# Altium schematic sheet FTDI.SchDoc
size A3; DocumentNumber: 5; SheetNumber: 5; SheetTotal: 9
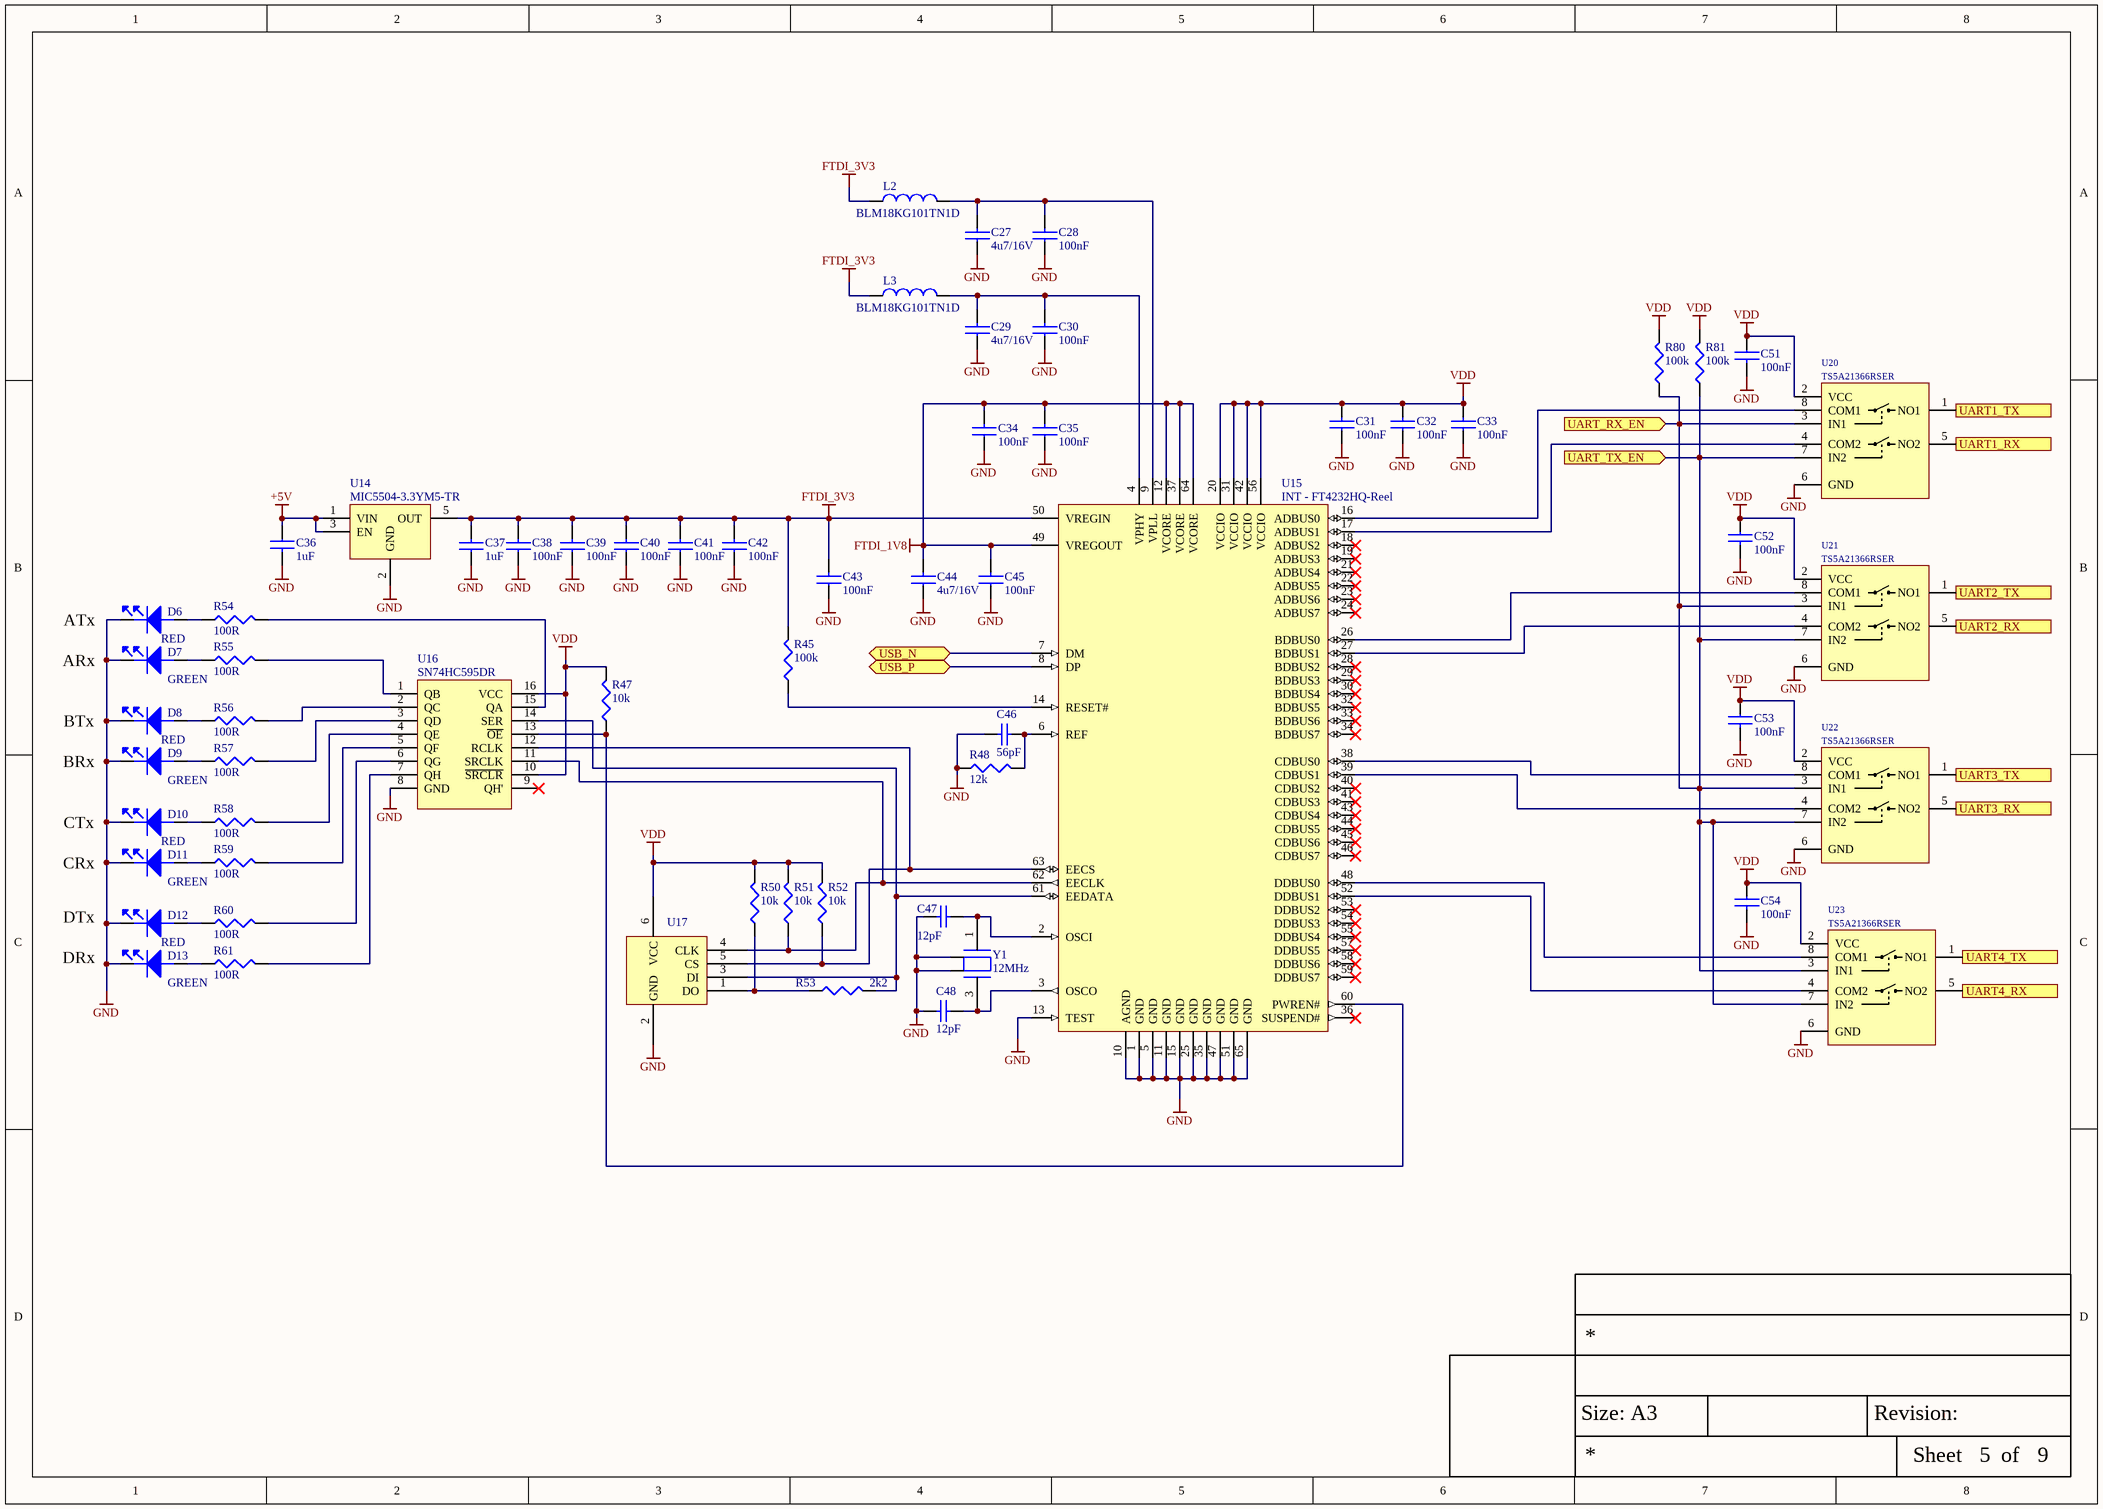
[diagram p0: FTDI.SchDoc]

## Parts
C27  4u7/16V  [CAP0603]
C28  100nF  [CAP0402]
C29  4u7/16V  [CAP0603]
C30  100nF  [CAP0402]
C31  100nF  [CAP0402]
C32  100nF  [CAP0402]
C33  100nF  [CAP0402]
C34  100nF  [CAP0402]
C35  100nF  [CAP0402]
C36  1uF  [CAP0402]
C37  1uF  [CAP0402]
C38  100nF  [CAP0402]
C39  100nF  [CAP0402]
C40  100nF  [CAP0402]
C41  100nF  [CAP0402]
C42  100nF  [CAP0402]
C43  100nF  [CAP0402]
C44  4u7/16V  [CAP0603]
C45  100nF  [CAP0402]
C46  value 56pF  [CAP0402]  (hidden comment: 56pF/50V/0402)
C47  value 12pF  [CAP0402]  (hidden comment: 12pF/50V/0402)
C48  value 12pF  [CAP0402]  (hidden comment: 12pF/50V/0402)
C51  100nF  [CAP0402]
C52  100nF  [CAP0402]
C53  100nF  [CAP0402]
C54  100nF  [CAP0402]
D6  LED RED  [LED0603]  (value not drawn)
D7  LED GREEN  [LED0603]  (value not drawn)
D8  LED RED  [LED0603]  (value not drawn)
D9  LED GREEN  [LED0603]  (value not drawn)
D10  LED RED  [LED0603]  (value not drawn)
D11  LED GREEN  [LED0603]  (value not drawn)
D12  LED RED  [LED0603]  (value not drawn)
D13  LED GREEN  [LED0603]  (value not drawn)
L2  BLM18KG101TN1D  [IND0603]
L3  BLM18KG101TN1D  [IND0603]
R45  100k  [RES0402]
R47  10k  [RES0402]
R48  12k  [RES0402]
R50  10k  [RES0402]
R51  10k  [RES0402]
R52  10k  [RES0402]
R53  2k2  [RES0402]
R54  100R  [RES0402]
R55  100R  [RES0402]
R56  100R  [RES0402]
R57  100R  [RES0402]
R58  100R  [RES0402]
R59  100R  [RES0402]
R60  100R  [RES0402]
R61  100R  [RES0402]
R80  100k  [RES0402]
R81  100k  [RES0402]
U14  MIC5504-3.3YM5-TR  [SOT23-5]
U15  INT - FT4232HQ-Reel  [QFN64_2_N]
U16  SN74HC595DR  [SOIC-16]
U17  93LC56BT-E/OT  [SOT95P270X145-6N]  (value not drawn)
U20  TS5A21366RSER  [UQFN-8]
U21  TS5A21366RSER  [UQFN-8]
U22  TS5A21366RSER  [UQFN-8]
U23  TS5A21366RSER  [UQFN-8]
Y1  12MHz  [CRY2.5X2]

## Ports
UART1_RX (in), UART1_TX (out), UART2_RX (in), UART2_TX (out), UART3_RX (in), UART3_TX (out), UART4_RX (in), UART4_TX (out), UART_RX_EN (in), UART_TX_EN (in), USB_N (bidir), USB_P (bidir)

## Nets
+5V: C36.1 U14.1(VIN) U14.3(EN)
FTDI_1V8: C34.2 C35.2 C44.2 C45.2 U15.12(VCORE) U15.37(VCORE) U15.49(VREGOUT) U15.64(VCORE)
FTDI_3V3: C37.2 C38.2 C39.2 C40.2 C41.2 C42.2 C43.2 L2.1 L3.1 R45.2 U14.5(OUT) U15.50(VREGIN)
GND: C27.1 C28.1 C29.1 C30.1 C31.1 C32.1 C33.1 C34.1 C35.1 C36.2 C37.1 C38.1 C39.1 C40.1 C41.1 C42.1 C43.1 C44.1 C45.1 C46.1 C47.1 C48.1 C51.2 C52.2 C53.2 C54.2 D6.1(cathode) D7.1(cathode) D8.1(cathode) D9.1(cathode) D10.1(cathode) D11.1(cathode) D12.1(cathode) D13.1(cathode) R48.1 U14.2(GND) U15.1(GND) U15.5(GND) U15.10(AGND) U15.11(GND) U15.13(TEST) U15.15(GND) U15.25(GND) U15.35(GND) U15.47(GND) U15.51(GND) U15.65(GND) U16.8(GND) U17.2(GND) U20.6(GND) U21.6(GND) U22.6(GND) U23.6(GND) Y1.2 Y1.4
VDD: C31.2 C32.2 C33.2 C51.1 C52.1 C53.1 C54.1 R47.2 R50.2 R51.2 R52.2 R80.2 R81.2 U15.20(VCCIO) U15.31(VCCIO) U15.42(VCCIO) U15.56(VCCIO) U16.10(~{SRCLR}) U16.16(VCC) U17.6(VCC) U20.2(VCC) U21.2(VCC) U22.2(VCC) U23.2(VCC)
UART1_RX: U20.5(NO2) ; port UART1_RX
UART1_TX: U20.1(NO1) ; port UART1_TX
UART2_RX: U21.5(NO2) ; port UART2_RX
UART2_TX: U21.1(NO1) ; port UART2_TX
UART3_RX: U22.5(NO2) ; port UART3_RX
UART3_TX: U22.1(NO1) ; port UART3_TX
UART4_RX: U23.5(NO2) ; port UART4_RX
UART4_TX: U23.1(NO1) ; port UART4_TX
UART_RX_EN: R80.1 R81.1 U20.3(IN1) U20.7(IN2) U21.3(IN1) U21.7(IN2) U22.3(IN1) U22.7(IN2) U23.3(IN1) U23.7(IN2) ; port UART_RX_EN, port UART_TX_EN
USB_N: U15.7(DM) ; port USB_N
USB_P: U15.8(DP) ; port USB_P
NetC27_2: C27.2 C28.2 L2.2 U15.9(VPLL)
NetC29_2: C29.2 C30.2 L3.2 U15.4(VPHY)
NetC46_2: C46.2 R48.2 U15.6(REF)
NetC47_2: C47.2 U15.2(OSCI) Y1.1
NetC48_2: C48.2 U15.3(OSCO) Y1.3
NetD6_2: D6.2(ANODE) R54.1
NetD7_2: D7.2(ANODE) R55.1
NetD8_2: D8.2(ANODE) R56.1
NetD9_2: D9.2(ANODE) R57.1
NetD10_2: D10.2(ANODE) R58.1
NetD11_2: D11.2(ANODE) R59.1
NetD12_2: D12.2(ANODE) R60.1
NetD13_2: D13.2(ANODE) R61.1
NetR45_1: R45.1 U15.14(RESET#)
NetR47_1: R47.1 U15.60(PWREN#) U16.13(~{OE})
NetR50_1: R50.1 R53.1 U17.1(DO)
NetR51_1: R51.1 U15.62(EECLK) U16.11(SRCLK) U17.4(CLK)
NetR52_1: R52.1 U15.63(EECS) U16.12(RCLK) U17.5(CS)
NetR53_2: R53.2 U15.61(EEDATA) U16.14(SER) U17.3(DI)
NetR54_2: R54.2 U16.15(QA)
NetR55_2: R55.2 U16.1(QB)
NetR56_2: R56.2 U16.2(QC)
NetR57_2: R57.2 U16.3(QD)
NetR58_2: R58.2 U16.4(QE)
NetR59_2: R59.2 U16.5(QF)
NetR60_2: R60.2 U16.6(QG)
NetR61_2: R61.2 U16.7(QH)
NetU15_16: U15.16(ADBUS0) U20.8(COM1)
NetU15_17: U15.17(ADBUS1) U20.4(COM2)
NetU15_26: U15.26(BDBUS0) U21.8(COM1)
NetU15_27: U15.27(BDBUS1) U21.4(COM2)
NetU15_38: U15.38(CDBUS0) U22.8(COM1)
NetU15_39: U15.39(CDBUS1) U22.4(COM2)
NetU15_48: U15.48(DDBUS0) U23.8(COM1)
NetU15_52: U15.52(DDBUS1) U23.4(COM2)

Not connected (* = marked no-connect by the designer): U15 18(ADBUS2)* 19(ADBUS3)* 21(ADBUS4)* 22(ADBUS5)* 23(ADBUS6)* 24(ADBUS7)* 28(BDBUS2)* 29(BDBUS3)* 30(BDBUS4)* 32(BDBUS5)* 33(BDBUS6)* 34(BDBUS7)* 36(SUSPEND#)* 40(CDBUS2)* 41(CDBUS3)* 43(CDBUS4)* 44(CDBUS5)* 45(CDBUS6)* 46(CDBUS7)* 53(DDBUS2)* 54(DDBUS3)* 55(DDBUS4)* 57(DDBUS5)* 58(DDBUS6)* 59(DDBUS7)*; U16 9(QH')*

## Notes on the sheet
- ATx
- ARx
- BTx
- BRx
- CTx
- CRx
- DTx
- DRx
- Size: A3
- Revision:
- Sheet
- of
- (in symbol LED - LED GREEN) GREEN
- (in symbol LED - LED RED) RED

## Library data of the parts
C27 C29 C44 = C - 4u7  16V 0603: MURATA - GRM188R61C475KAAJD - CAP, MLCC, X5R, 4.7UF, 16V, 0603; IRNAS Part No.: I-200001; Ceramic Capacitor Case: 0603 [1608 Metric]; Capacitance: 4.7; Voltage Rating: 16; Capacitance Tolerance: ± 10%; Dielectric Characteristic: X5; Product Range: GRM Series; SVHC: No SVHC (17-Dec-2015)<!--FANDB--><div class="features-and-benefits-container"><div class="features-and-benefits-desc-container"><span class="features-and-benefits-container-desc">SMD Multilayer Ceramic Capacitor, 0603 [1608 Metric], 4.7 µF, 16 V, ± 10%, X5; Supplier 1: Farnell; Manufacturer: MURATA; Manufacturer Part Number: GRM188R61C475KAAJD; RoHS: YES; Stock 1: 5038; Pricing 1: 10=0.16, 100=0.0929, 500=0.076, 1000=0.0618, 2000=0.0605, 4000=0.0425, 20000=0.0409, 40000=0.0355 (GBP); Packaging: Cut Tape; Operating Temperature Min: -55; Operating Temperature Max: 85; Automotive Qualification Standard: -; MSL: MSL 1 - Unlimited; ComponentLink1URL: http://www.farnell.com/datasheets/2079168.pdf; ComponentLink1Description: http://www.farnell.com/datasheets/2079168.pdf; Supplier Part Number 1: 2611924
C28 C30-C35 C38-C43 C45 C51-C54 = C - 100nF/0402: MULTICOMP         MC0402X104J160CT             SMD Multilayer Ceramic Capacitor, 0402 [1005 Metric], 0.1 F, 16 V,  5%, X5R, MC Series                          New; IRNAS Part No.: /; Voltage Rating: 16V; Supplier 1: Farnell; Manufacturer: Multicomp; Manufacturer Part Number: MC0402X104J160CT; Stock 1: 3230; Pricing 1: 10=0.0139, 100=0.0108, 500=0.0076, 2500=0.0051, 5000=0.0038 (EUR); Case Code (Metric): 1005; Case Code (Imperial): 0402; Min Operating Temperature: -55°C; Max Operating Temperature: 85°C; Capacitance: 100nF; Dielectric: X5R; Packaging: Tape and Reel; Tolerance: 5%; Voltage Rating (DC): 16V; REACH SVHC: No SVHC; ComponentLink1URL: http://www.farnell.com/datasheets/2117933.pdf; ComponentLink1Description: http://www.farnell.com/datasheets/2117933.pdf; ComponentLink2URL: http://www.farnell.com/datasheets/2117900.pdf; ComponentLink2Description: http://www.farnell.com/datasheets/2117900.pdf; Supplier Part Number 1: 2627419
C36 C37 = C - 1uF/0402: CAP CER 1UF 10V 20% X5R 0402; Manufacturer: Murata; Manufacturer Part Number: GRM155R61A105ME15D; IRNAS Part No.: /; Supplier 1: Farnell; Stock 1: 0; Pricing 1: 10=0.0379, 100=0.0266, 500=0.0156, 2500=0.0098, 5000=0.0083 (EUR); Mount: Surface Mount; Case/Package: 0402; Case Code (Metric): 1005; Case Code (Imperial): 0402; Min Operating Temperature: -55°C; Max Operating Temperature: 85°C; Capacitance: 1uF; Tolerance: 20%; Voltage Rating: 10V; Packaging: Tape and Reel; Package Quantity: 1; Dielectric: X5R; Voltage: 10V; Voltage Rating (DC): 10V; Length: 1mm; Height: 0.5mm; Width: 0.02inch; Thickness: 0.022inch; Depth: 0.5mm; Radiation Hardening: No; REACH SVHC: No SVHC; Lead Free: Lead Free; ComponentLink1URL: https://datasheet.ciiva.com/164/product-164665.pdf; ComponentLink1Description: https://datasheet.ciiva.com/164/product-164665.pdf; ComponentLink2URL: https://datasheet.ciiva.com/11616/product-11616508.pdf; ComponentLink2Description: https://datasheet.ciiva.com/11616/product-11616508.pdf; ComponentLink3URL: https://datasheet.ciiva.com/46418/1769893-46418047.pdf; ComponentLink3Description: https://datasheet.ciiva.com/46418/1769893-46418047.pdf; ComponentLink4URL: https://datasheet.ciiva.com/164/partnumbering-e-01-164666.pdf; ComponentLink4Description: https://datasheet.ciiva.com/164/partnumbering-e-01-164666.pdf; ComponentLink5URL: https://datasheet.ciiva.com/164/partnumbering-e-01-164667.pdf; ComponentLink5Description: https://datasheet.ciiva.com/164/partnumbering-e-01-164667.pdf; Supplier Part Number 1: 2426953
C46 = C - 56pF/50V/0402: CAP CER 56PF 50V C0G/NP0 0402; Published: 8-Jun-2000; LatestRevisionDate: 05-oct-2007  -  Semtech; LatestRevisionNote: Re-released for DXP Platform.; Publisher: Altium Limited; Supplier 1: Digi-Key; Supplier Part Number 1: 490-1288-1-ND
C47 C48 = C - 12pF/50V/0402: CAP CER 12PF 50V C0G/NP0 0402; Published: 8-Jun-2000; LatestRevisionDate: 05-oct-2007  -  Semtech; LatestRevisionNote: Re-released for DXP Platform.; Publisher: Altium Limited; Supplier 1: Digi-Key; Supplier Part Number 1: 490-5924-1-ND
D6 D8 D10 D12 = LED - LED RED: BROADCOM LIMITED - HSMS-C190 - LED, RED, 10MCD, 626NM; LED Mounting: SMD; Forward Current If: 20; Forward Voltage: 2.1; Wavelength Typ: 626; Luminous Intensity: 10; Viewing Angle: 170°; Lens Shape: Rectangular; SVHC: No SVHC (17-Dec-2015)<!--FANDB--><div class="features-and-benefits-container"><div class="features-and-benefits-description"><span class="features-benefits-value">The HSMS-C190 is a HER SMD Chip LED with untinted/diffused lens, made of GaP. It is designed in an industry standard package 1.6 x 0.8mm footprint with 0.8mm profile. It is compatible with IR reflow solder processes. The small size and wide viewing angle make this LED prime choices for backlighting applications and front panel illumination especially where space is a premium.</span></div><div class="features-and-benefits-list"><ul class="features-and-benefits-list-list"><li class="features-and-benefits-list-item">Small size</li><li class="features-and-benefits-list-item">Industry standard footprint</li><li class="features-and-benefits-list-item">Compatible with IR solder</li><li class="features-and-benefits-list-item">Diffused optics</li><li class="features-and-benefits-list-item">-40 to 85; Supplier 1: Farnell; Manufacturer: BROADCOM LIMITED; Manufacturer Part Number: HSMS-C190; RoHS: YES; Stock 1: 7534; Pricing 1: 1=0.361, 10=0.256, 50=0.235, 100=0.106, 200=0.101 (GBP); LED Colour: Red; Bulb Size: -; Packaging: Cut Tape; Product Range: -; Automotive Qualification Standard: -; MSL: -; ComponentLink1URL: http://www.farnell.com/datasheets/313031.pdf; ComponentLink1Description: http://www.farnell.com/datasheets/313031.pdf; ComponentLink2URL: http://www.farnell.com/datasheets/1681524.pdf; ComponentLink2Description: http://www.farnell.com/datasheets/1681524.pdf; ComponentLink3URL: http://www.farnell.com/datasheets/2165483.pdf; ComponentLink3Description: http://www.farnell.com/datasheets/2165483.pdf; Supplier Part Number 1: 2497356
D7 D9 D11 D13 = LED - LED GREEN: HSME-C191 -  LED, Green, SMD, 0603, 20 mA, 2.1 V, 572 nm; Manufacturer: BROADCOM LIMITED; Manufacturer Part Number: HSMS-C190; LED Colour: Red; Forward Current If: 20; Forward Voltage: 2.1; Wavelength Typ: 626; Luminous Intensity: 10; Viewing Angle: 170°; Lens Shape: Rectangular; SVHC: No SVHC (17-Dec-2015)<!--FANDB--><div class="features-and-benefits-container"><div class="features-and-benefits-description"><span class="features-benefits-value">The HSMS-C190 is a HER SMD Chip LED with untinted/diffused lens, made of GaP. It is designed in an industry standard package 1.6 x 0.8mm footprint with 0.8mm profile. It is compatible with IR reflow solder processes. The small size and wide viewing angle make this LED prime choices for backlighting applications and front panel illumination especially where space is a premium.</span></div><div class="features-and-benefits-list"><ul class="features-and-benefits-list-list"><li class="features-and-benefits-list-item">Small size</li><li class="features-and-benefits-list-item">Industry standard footprint</li><li class="features-and-benefits-list-item">Compatible with IR solder</li><li class="features-and-benefits-list-item">Diffused optics</li><li class="features-and-benefits-list-item">-40 to 85; RoHS: YES; Stock 1: 7534; Pricing 1: 1=0.361, 10=0.256, 50=0.235, 100=0.106, 200=0.101 (GBP); LED Mounting: SMD; Bulb Size: -; Packaging: Cut Tape; Product Range: -; Automotive Qualification Standard: -; MSL: -; ComponentLink3URL: http://www.farnell.com/datasheets/2095939.pdf?_ga=2.85835929.1644194861.1561957338-1373726713.1554121096; ComponentLink3Description: Datasheet; Supplier 1: Farnell; Supplier Part Number 1: 1219743
L2 L3 = L - BLM18KG101TN1D: Ferrite Bead, 0603 [1608 Metric], 100 ohm, 3 A, BLM18K Series, 0.03 ohm, ± 25%; ComponentLink1Description: Datasheet; ComponentLink1URL: https://www.murata.com/en-global/api/pdfdownloadapi?cate=luNoiseSupprFilteChipFerriBead&partno=BLM18KG101TN1%23; Supplier 1: Farnell; Supplier Part Number 1: 2443239
R45 R80 R81 = R - 100k/0402: MULTICOMP   MCWR04X1003FTL   RES, THICK FILM, 100KOHM, 1%, 0.0625W; IRNAS Part No.: I-100013; Resistance: 100kR; Power Rating: 62.5mW; Voltage Rating: 50V; Temperature Coefficient: 100ppm/°C; Supplier 1: Farnell; Manufacturer: Multicomp; Manufacturer Part Number: MCWR04X1003FTL; Stock 1: 161188; Pricing 1: 10=0.0029, 100=0.0017, 500=0.0012, 2500=0.001, 5000=0.0008 (EUR); Mount: Surface Mount; Case/Package: 0402; Case Code (Metric): 1005; Case Code (Imperial): 0402; Tolerance: 1%; Packaging: Cut Tape; Composition: Thick Film; Voltage Rating (DC): 50V; REACH SVHC: No SVHC; ComponentLink1URL: https://datasheet.ciiva.com/46386/1849611-46386524.pdf; ComponentLink1Description: https://datasheet.ciiva.com/46386/1849611-46386524.pdf; Supplier Part Number 1: 2447094
R47 R50-R52 = R - 10k/0402: MULTICOMP         MCWR04X1002FTL             SMD Chip Resistor, Thick Film, 10 kohm, 50 V, 0402 [1005 Metric], 62.5 mW,  1%, MCWR Series; IRNAS Part No.: I-100014; Resistance: 10kR; Voltage Rating: 50V; Power Rating: 62.5mW; Temperature Coefficient: 100ppm/°C; Supplier 1: Farnell; Manufacturer: Multicomp; Manufacturer Part Number: MCWR04X1002FTL; Stock 1: 602609; Pricing 1: 10=0.0029, 100=0.0017, 500=0.0012, 2500=0.001, 5000=0.0008 (EUR); Case/Package: 0402; Case Code (Metric): 1005; Case Code (Imperial): 0402; Packaging: Cut Tape; Composition: Thick Film; Tolerance: 1%; Voltage Rating (DC): 50V; REACH SVHC: No SVHC; ComponentLink1URL: http://www.farnell.com/datasheets/1849611.pdf; ComponentLink1Description: http://www.farnell.com/datasheets/1849611.pdf; Supplier Part Number 1: 2447096
R48 = R - 12k/0402: MULTICOMP         MCWR04X1202FTL             SMD Chip Resistor, Thick Film, 12 kohm, 50 V, 0402 [1005 Metric], 62.5 mW,  1%, MCWR Series; IRNAS Part No.: /; Voltage Rating (DC): 50V; Resistance: 12kR; Power Rating: 62.5mW; Temperature Coefficient: 100ppm/°C; Supplier 1: Farnell; Manufacturer: Multicomp; Manufacturer Part Number: MCWR04X1202FTL; Stock 1: 11542; Pricing 1: 10=0.0033, 100=0.002, 500=0.0014, 2500=0.0011, 5000=0.0009 (EUR); Case/Package: 0402; Case Code (Metric): 1005; Case Code (Imperial): 0402; Packaging: Cut Tape; Tolerance: 1%; Voltage Rating: 50V; Composition: Thick Film; REACH SVHC: No SVHC; ComponentLink1URL: http://www.farnell.com/datasheets/1849611.pdf; ComponentLink1Description: http://www.farnell.com/datasheets/1849611.pdf; Supplier Part Number 1: 2447104
R53 = R - 2k2/0402: SMD Chip Resistor, 2.2 kohm, ± 1%, 62.5 mW, 0402 [1005 Metric], Thick Film, General Purpose /; ComponentLink1Description: Datasheet; ComponentLink1URL: http://www.farnell.com/datasheets/2860681.pdf?_ga=2.145444532.1645569087.1597147308-393619177.1578660480; Supplier 1: Farnell; Supplier Part Number 1: 2447148
R54-R61 = R - 100R/0402: MULTICOMP         MCMR04X1000FTL            SMD Chip Resistor, Ceramic, MCMR Series, 100 ohm, 50 V, 0402 [1005 Metric], 62.5 mW,  1%; IRNAS Part No.: /; Temperature Coefficient: 100ppm/°C; Power Rating: 62.5mW; Voltage Rating: 50V; Supplier 1: Farnell; Manufacturer: Multicomp; Manufacturer Part Number: MCMR04X1000FTL; Stock 1: 62365; Pricing 1: 10=0.0071, 100=0.0042, 500=0.003, 2500=0.0024, 5000=0.0019 (GBP); Case/Package: 0402; Case Code (Metric): 1005; Case Code (Imperial): 0402; Resistance: 100R; Tolerance: 1%; Composition: Ceramic; Packaging: Cut Tape; Voltage Rating (DC): 50V; REACH SVHC: No SVHC; ComponentLink1URL: https://datasheet.ciiva.com/28692/1716705-28692087.pdf; ComponentLink1Description: https://datasheet.ciiva.com/28692/1716705-28692087.pdf; ComponentLink2URL: https://datasheet.ciiva.com/22708/1716705-22708156.pdf; ComponentLink2Description: https://datasheet.ciiva.com/22708/1716705-22708156.pdf; Supplier Part Number 1: 2072515
U14 = V_LIN - MIC5504-3.3YM5-TR: Fixed LDO Voltage Regulator, 2.5V to 5.5V, 160mV Dropout, 3.3Vout, 300mAout, SOT-23-5; Manufacturer: ON SEMICONDUCTOR; Manufacturer Part Number: LM2596DSADJG; Topology: Buck (Step Down); Input Voltage Min: 4.5; Input Voltage Max: 45; No. of Outputs: 1; DC / DC Converter IC Case: TO-263; No. of Pins: 5; Output Current: 3; Output Voltage Min: 1.23; Output Voltage Max: 37; Switching Frequency: 150; SVHC: No SVHC (12-Jan-2017; RoHS: YES; Operating Temperature Max: 125; Packaging: Each; Product Range: -; Automotive Qualification Standard: -; MSL: MSL 1 - Unlimited; ComponentLink1Description: Datasheet; ComponentLink1URL: http://www.farnell.com/datasheets/2108564.pdf?_ga=2.247133379.691918385.1573213895-1730437145.1573213895; Supplier 1: Farnell; Supplier Part Number 1: 2510377
U15 = INT - FT4232HQ-Reel: Quad High Speed USB To Multipurpose UART/MPSSE IC, 64-pin QFN, Tape and Reel; Manufacturer: FTDI; DatasheetVersion: ver 2.2, Jan-2012; PackageVersion: Jan-12; PackageReference: QFN64_2; PackageDescription: 64-Pin Quad Flat No-Lead, 9 x 9 mm Body, 0.5 mm Pitch, 4.35 x 4.35 mm Exposed Pad; PartNumber: FT4232HQ-Reel; ComponentLink1Description: Manufacturer URL; ComponentLink1URL: http://www.ftdichip.com/; ComponentLink2Description: Datasheet; ComponentLink2URL: http://www.ftdichip.com/Support/Documents/DataSheets/ICs/DS_FT4232H.pdf
U16 = INT - SN74HC595DR: Shift Register, 74HC595, Serial to Parallel, 1 Element, 8 bit, SOIC, 16 Pins; Supplier 1: Farnell; Supplier Part Number 1: 3006739
U17 = MEM - 93LC56BT-E/OT: 2K,  128 X 16,  SERIAL EE,   EXT6 SOT-23  T/R; Manufacturer: Microchip; Max Supply Voltage: 5.5V; Min Supply Voltage: 2.5V; Access Time: 250ns; Frequency: 2MHz; Nominal Supply Current: 2mA; Density: 2Kb; Memory Type: EEPROM; Supplier 1: Digi-Key; Manufacturer Part Number: 93LC56BT-E/OT; Stock 1: 1557; Pricing 1: 1 = 0.29000, 25 = 0.28360, 100 = 0.27300 (USD); RoHS: Yes; Mount: Surface Mount; Case/Package: SOT-23-6; Number of Pins: 6; Min Operating Temperature: -40°C; Max Operating Temperature: 125°C; Package Quantity: 3000; Packaging: Tape and Reel; Interface: Serial; Memory Size: 2Kb; Max Frequency: 2MHz; Radiation Hardening: No; Lead Free: Lead Free; ComponentLink1URL: https://datasheet.ciiva.com/16622/jp013939-16622122.pdf?src-supplier=Avnet+Europe; ComponentLink1Description: https://datasheet.ciiva.com/16622/jp013939-16622122.pdf?src-supplier=Avnet+Europe; ComponentLink2URL: https://datasheet.ciiva.com/9281/jp013939-9281661.pdf?src-supplier=Avnet; ComponentLink2Description: https://datasheet.ciiva.com/9281/jp013939-9281661.pdf?src-supplier=Avnet; Supplier Part Number 1: 93LC56BT-E/OTCT-ND
U20-U23 = SW - TS5A21366RSER: IC SWITCH DUAL SPST 8QFN; Opis / Description: TS5A21366RSER; Value: TS5A21366RSER; Supplier 1: Digi-Key; Supplier Part Number 1: 296-25285-1-ND
Y1 = X - 16MHz: 12MHz ±20ppm Crystal 10pF 150 Ohm -40°C ~ 85°C  Surface Mount 4-SMD, No Lead (DFN, LCC); Manufacturer: Abracon; Manufacturer Part Number: ABM10-166-12.000MHZ-T3; IRNAS Part No.: /; ESR (Equivalent Series Resistance): 150R; Frequency Stability: 30ppm; Supplier 1: Farnell; Stock 1: 8209; Pricing 1: 5=1.18, 50=0.742, 250=0.675, 500=0.607, 1500=0.569, 3000=0.558, 15000=0.547 (EUR); Mount: Surface Mount; Case/Package: CSMD; Number of Pins: 4; Min Operating Temperature: -40°C; Max Operating Temperature: 85°C; Package Quantity: 3000; Packaging: Tape and Reel; Frequency: 12MHz; Load Capacitance: 10pF; Tolerance: 20ppm; Frequency Tolerance: 20ppm; Termination: SMD/SMT; Series Resistance: 150R; Length: 2.5mm; Height: 0.028inch; Width: 2mm; Depth: 2mm; Lead Free: Lead Free; REACH SVHC: No SVHC; ComponentLink1URL: https://datasheet.ciiva.com/16410/abm10-16410918.pdf; ComponentLink1Description: https://datasheet.ciiva.com/16410/abm10-16410918.pdf; ComponentLink2URL: https://datasheet.ciiva.com/856/abm10-856088.pdf; ComponentLink2Description: https://datasheet.ciiva.com/856/abm10-856088.pdf; ComponentLink3URL: https://datasheet.ciiva.com/856/abm10-856089.pdf; ComponentLink3Description: https://datasheet.ciiva.com/856/abm10-856089.pdf; ComponentLink4URL: https://datasheet.ciiva.com/856/abm10-856090.pdf; ComponentLink4Description: https://datasheet.ciiva.com/856/abm10-856090.pdf; Supplier Part Number 1: 2849406